# EAGLE design neckmed-2 (EAGLE 9.6.2)
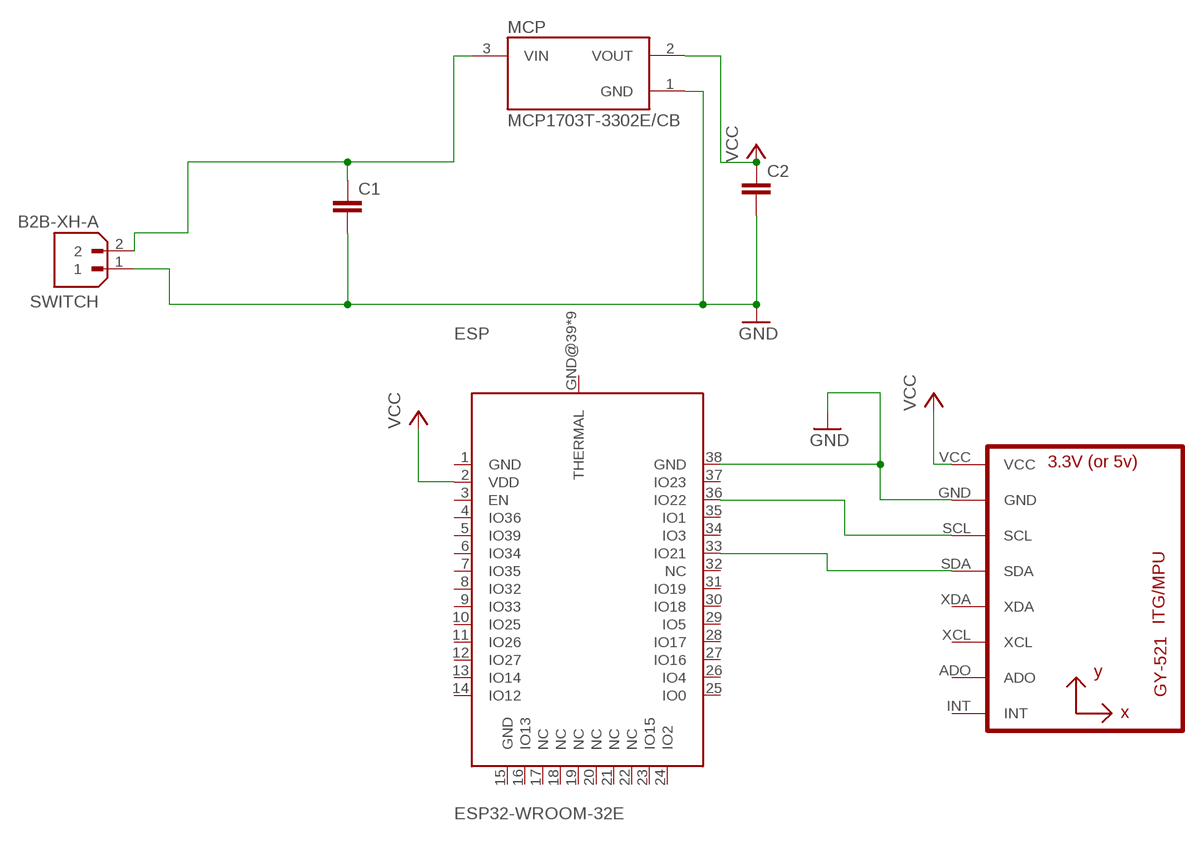
[diagram p0: schematic, sheet 1]

## Parts
C1  C-EU025-040X050  [C025-040X050]
C2  C-EU025-040X050  [C025-040X050]
ESP  ESP32-WROOM-32E  [ESP32-WROOM-32E]
GY  GY-521MPU6050  [GY-521]
MCP  MCP1703T-3302E/CB  [SOT95P255X145-3N]
SWITCH  B2B-XH-A  [JST_B2B-XH-A]

## Nets
GND: C1.2 C2.2 ESP.38(GND) GY.GND MCP.1(GND) SWITCH.1
N$5: C1.1 MCP.3(VIN) SWITCH.2
N$8: ESP.36(IO22) GY.SCL
N$9: ESP.33(IO21) GY.SDA
VCC: C2.1 ESP.2(VDD) GY.VCC MCP.2(VOUT)
Unconnected: ESP.1(GND) ESP.3(EN) ESP.4(IO36) ESP.5(IO39) ESP.6(IO34) ESP.7(IO35) ESP.8(IO32) ESP.9(IO33) ESP.10(IO25) ESP.11(IO26) ESP.12(IO27) ESP.13(IO14) ESP.14(IO12) ESP.15(GND) ESP.16(IO13) ESP.17(NC) ESP.18(NC) ESP.19(NC) ESP.20(NC) ESP.21(NC) ESP.22(NC) ESP.23(IO15) ESP.24(IO2) ESP.25(IO0) ESP.26(IO4) ESP.27(IO16) ESP.28(IO17) ESP.29(IO5) ESP.30(IO18) ESP.31(IO19) ESP.32(NC) ESP.34(IO3) ESP.35(IO1) ESP.37(IO23) ESP.GND@39(THERMAL) ESP.GND@40(THERMAL) ESP.GND@41(THERMAL) ESP.GND@42(THERMAL) ESP.GND@43(THERMAL) ESP.GND@44(THERMAL) ESP.GND@45(THERMAL) ESP.GND@46(THERMAL) ESP.GND@47(THERMAL) GY.ADO GY.INT GY.XCL GY.XDA

## Library data of the parts
C1 C2 = rcl:C-EU: CAPACITOR, European symbol; SPICEPREFIX: C
ESP = ESP32-WROOM-32E:ESP32-WROOM-32E: Check availability <https://pricing.snapeda.com/parts/ESP32-WROOM-32E/Espressif%20Systems/view-part?ref=eda>; AVAILABILITY: In Stock; CHECK_PRICES: https://www.snapeda.com/parts/ESP32-WROOM-32E/Espressif+Systems/view-part/?ref=eda; DESCRIPTION: RX TXRX MOD WIFI TRACE ANT SMD; MF: Espressif Systems; MP: ESP32-WROOM-32E; PACKAGE: SMD-44 Espressif Systems; PRICE: None; SNAPEDA_LINK: https://www.snapeda.com/parts/ESP32-WROOM-32E/Espressif+Systems/view-part/?ref=snap
GY = GY-521:GY-521: Check availability <https://pricing.snapeda.com/parts/GY-521/GODREAM%20FORDREAM%20CO.%2C%20LIMITED/view-part?ref=eda>; AVAILABILITY: Not in stock; CHECK_PRICES: https://www.snapeda.com/parts/GY-521/GODREAM+FORDREAM+CO.%252C+LIMITED/view-part/?ref=eda; DESCRIPTION: Triple Axis Accelerometer Gyro Breakout; MF: GODREAM FORDREAM CO., LIMITED; MP: GY-521; PACKAGE: Package; PRICE: None; SNAPEDA_LINK: https://www.snapeda.com/parts/GY-521/GODREAM+FORDREAM+CO.%252C+LIMITED/view-part/?ref=snap
MCP = MCP1703T-3302E_CB:MCP1703T-3302E/CB: Linear Voltage Regulator IC 1 Output 250mA SOT-23A-3 Check availability <https://pricing.snapeda.com/parts/MCP1703T-3302E/CB/Microchip/view-part?ref=eda>; AVAILABILITY: In Stock; CHECK_PRICES: https://www.snapeda.com/parts/MCP1703T-3302E/CB/Microchip/view-part/?ref=eda; DESCRIPTION: Pwr Sply Func,Voltage Regulator,LDO,SOT-23A,IS 2uA,PD 253mW,VO 3.3V,Regload+/-1% | Microchip Technology Inc. MCP1703T-3302E/CB; MF: Microchip; MP: MCP1703T-3302E/CB; PACKAGE: SOT23A Microchip; PRICE: None; PURCHASE-URL: https://www.snapeda.com/api/url_track_click_mouser/?unipart_id=47542&manufacturer=Microchip&part_name=MCP1703T-3302E/CB&search_term=mcp1703 3302; SNAPEDA_LINK: https://www.snapeda.com/parts/MCP1703T-3302E/CB/Microchip/view-part/?ref=snap
SWITCH = B2B-XH-A:B2B-XH-A: Check availability <https://pricing.snapeda.com/parts/B2B-XH-A/JST%20Sales/view-part?ref=eda>; AVAILABILITY: In Stock; CHECK_PRICES: https://www.snapeda.com/parts/B2B-XH-A/JST+Sales+America+Inc./view-part/?ref=eda; DESCRIPTION: Connector Header Through Hole 2 position 0.098 (2.50mm); MF: JST Sales; MP: B2B-XH-A; PACKAGE: None; PRICE: None; PURCHASE-URL: https://www.snapeda.com/api/url_track_click_mouser/?unipart_id=552747&manufacturer=JST Sales&part_name=B2B-XH-A&search_term=jwt xh; SNAPEDA_LINK: https://www.snapeda.com/parts/B2B-XH-A/JST+Sales+America+Inc./view-part/?ref=snap

## Board
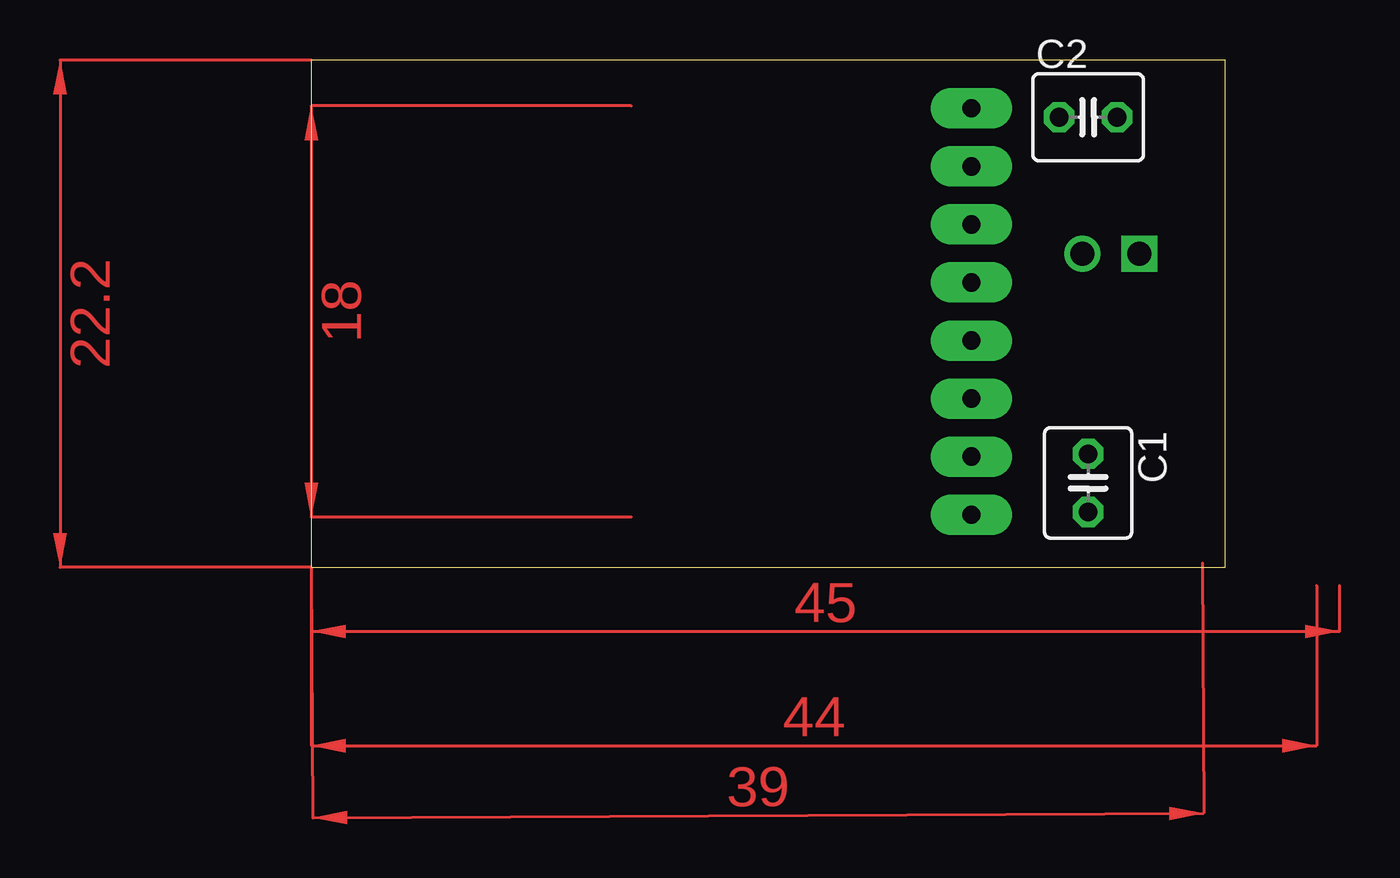
[diagram p1: board, top side]
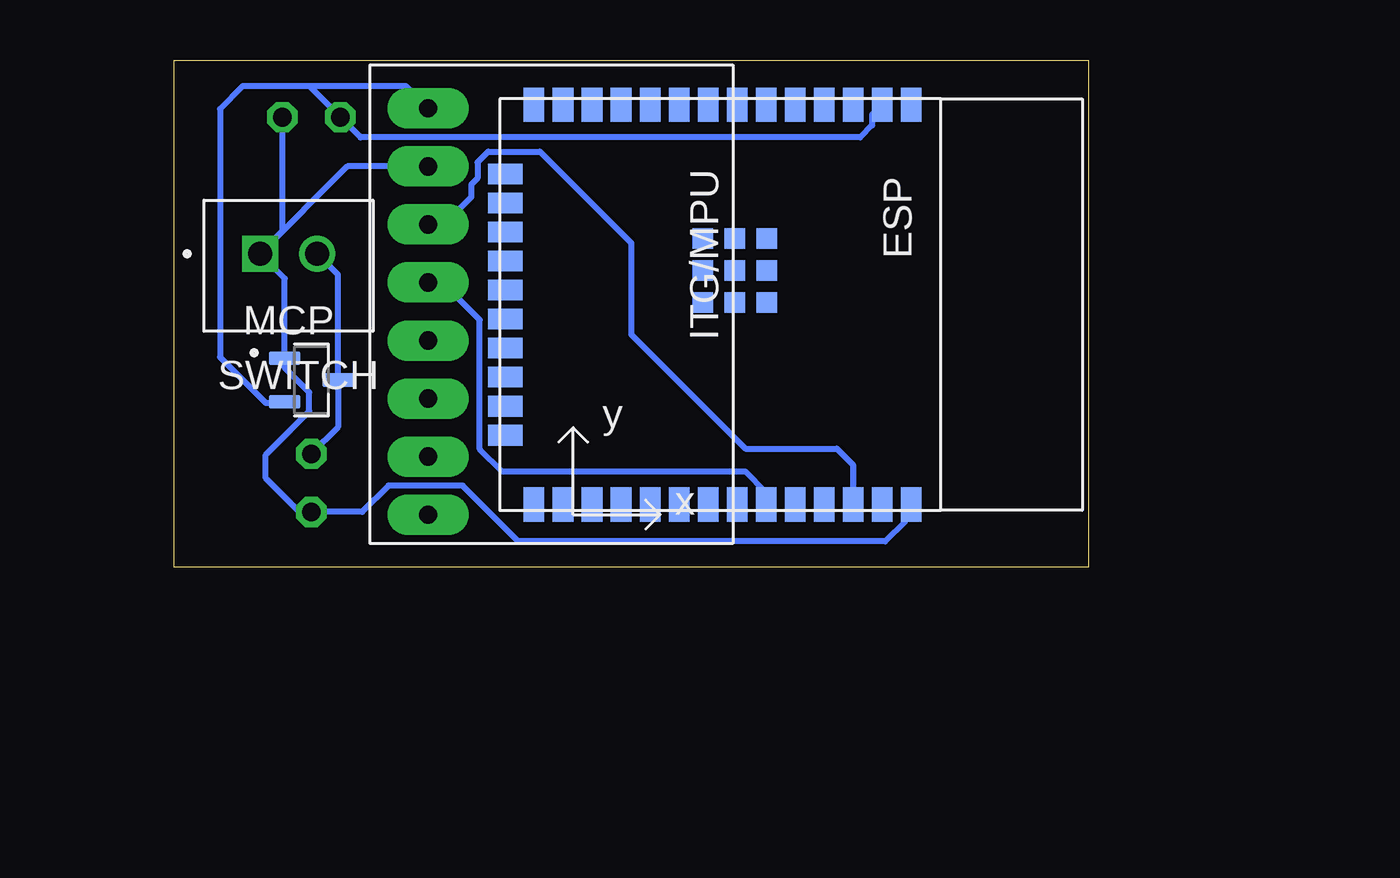
[diagram p2: board, bottom side, seen from below]

Size 40 x 22.2 mm. Coordinates in mm from the lower left corner, seen from the top.
Outline: 0,0 40,0 40,22.2 0,22.2 0,0
Copper layers (1*16): Top 0.035mm / dielectric 1.5mm / Bottom 0.035mm
Design rules "default *": minimum track width 10mil, minimum drill 0.35mm, track to track 10mil, track to pad 10mil, pad to pad 10mil, via to via 10mil, smd to smd 10mil, copper to edge 40mil, drill to drill 10mil, minimum pad ring 10mil, minimum via ring 8mil, stop-mask expansion 4mil, vias tented up to drill 0mil, thermal gap 10mil

### Footprints (pad centres in the part's own frame; a part is rotated, then mirrored left to right if it is on the bottom)
C025-040X050 = drill 0.813 octagon: 1 -1.27,0; 2 1.27,0
ESP32-WROOM-32E = smd 1.5 x 0.9: 1 -8.75,8.255; 2 -8.75,6.985; 3 -8.75,5.715; 4 -8.75,4.445; 5 -8.75,3.175; 6 -8.75,1.905; 7 -8.75,0.635; 8 -8.75,-0.635; 9 -8.75,-1.905; 10 -8.75,-3.175; 11 -8.75,-4.445; 12 -8.75,-5.715; 13 -8.75,-6.985; 14 -8.75,-8.255; 25 8.75,-8.255; 26 8.75,-6.985; 27 8.75,-5.715; 28 8.75,-4.445; 29 8.75,-3.175; 30 8.75,-1.905; 31 8.75,-0.635; 32 8.75,0.635; 33 8.75,1.905; 34 8.75,3.175; 35 8.75,4.445; 36 8.75,5.715; 37 8.75,6.985; 38 8.75,8.255 | smd 0.9 x 1.5: 15 -5.715,-9.505; 16 -4.445,-9.505; 17 -3.175,-9.505; 18 -1.905,-9.505; 19 -0.635,-9.505; 20 0.635,-9.505; 21 1.905,-9.505; 22 3.175,-9.505; 23 4.445,-9.505; 24 5.715,-9.505 | smd 0.9 x 0.9: GND@39 -2.9,1.935; GND@40 -1.5,1.935; GND@41 -0.1,1.935; GND@42 -2.9,0.535; GND@43 -1.5,0.535; GND@44 -0.1,0.535; GND@45 -2.9,-0.865; GND@46 -1.5,-0.865; GND@47 -0.1,-0.865
GY-521 = drill 0.8 pad 1.778 long: ADO -8.89,-6.35; GND -8.89,6.35; INT -8.89,-8.89; SCL -8.89,3.81; SDA -8.89,1.27; VCC -8.89,8.89; XCL -8.89,-3.81; XDA -8.89,-1.27
SOT95P255X145-3N = smd 1.38 x 0.6: 1 -1.165,0.95; 2 -1.165,-0.95; 3 1.165,0
JST_B2B-XH-A = drill 1.05 square: 1 1.25,-0.525 | drill 1.05: 2 -1.25,-0.525

### Placement (x,y rotation side)
C1  34,3.7 270 top
C2  34,19.7 0 top
ESP  16,11.5 270 bottom
GY  20,11.2 0 bottom
MCP  34,8.2 0 bottom
SWITCH  35,13.2 180 bottom

### Tracks (layer width: path | path; a pad name or v marks a point on that pad's centre or on a via)
GND
  Bottom 0.254: ESP.38 8,2.5 8,2.03 8.88,1.14 24.94,1.14 27.38,3.58 30.62,3.58 31.77,2.43 C1.2 34.52,2.43 36,3.91 36,4.93 34.09,6.84 34.09,7.66 35.16,8.73 MCP.1 35.16,12.64 SWITCH.1 | C2.2 35.27,14.71 SWITCH.1 | GY.GND 32.42,17.55 SWITCH.1
N$5
  Bottom 0.254: C1.1 32.84,6.13 MCP.3 32.84,12.81 SWITCH.2
N$8
  Bottom 0.254: ESP.36 10.29,4.49 11,5.2 15,5.2 20,10.2 20,14.2 24,18.2 26.26,18.2 26.73,17.73 26.73,17.02 27,16.75 27,16.2 28.19,15.01 GY.SCL
N$9
  Bottom 0.254: ESP.33 14.1,3.3 15,4.2 25.66,4.2 26.64,5.18 26.64,10.84 28.27,12.47 GY.SDA
VCC
  Bottom 0.254: ESP.2 9.45,19.81 9.45,19.34 9.98,18.82 31.85,18.82 C2.1 34.09,21.06 | 34.09,21.06 37,21.06 38,20.06 38,9.2 36,7.2 35.22,7.2 MCP.2 | GY.VCC 29.86,21.06 34.09,21.06
(copper drawn outside any net)
  shapes: Top area x5